# EasyEDA Pro project 农装_2025-08-27.epro, board PCB3_1
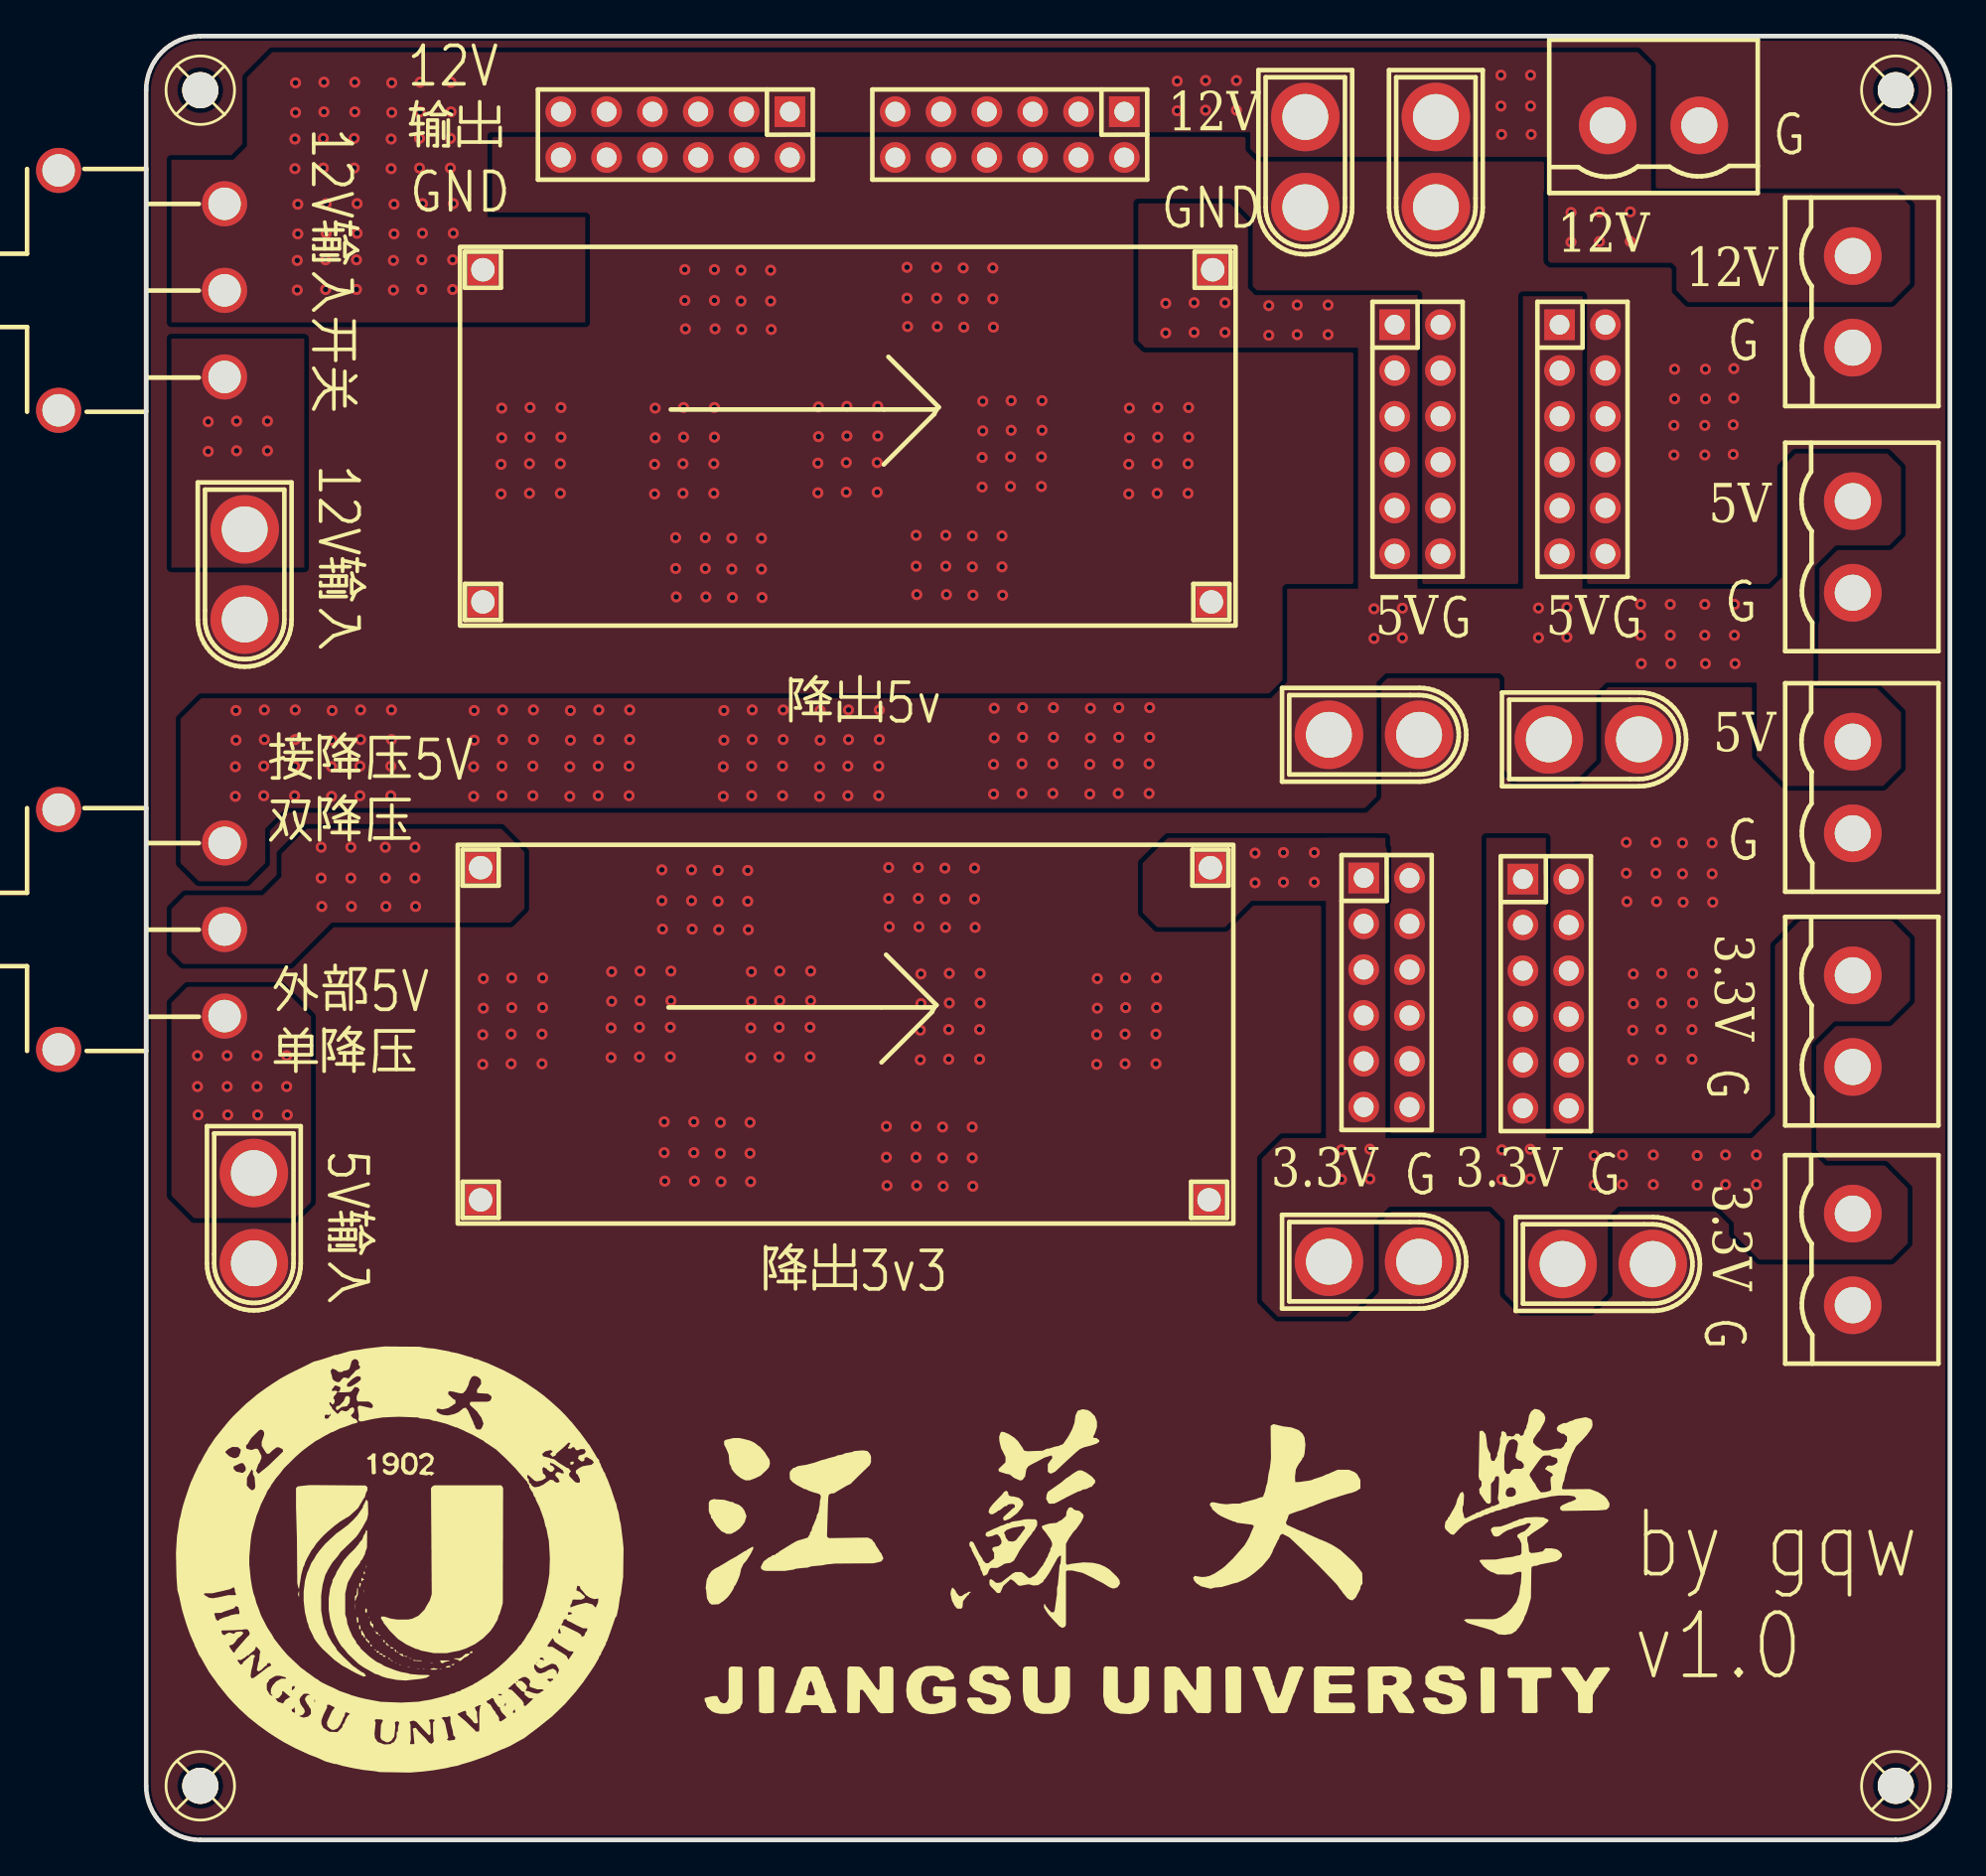
[diagram p2: board, top side]
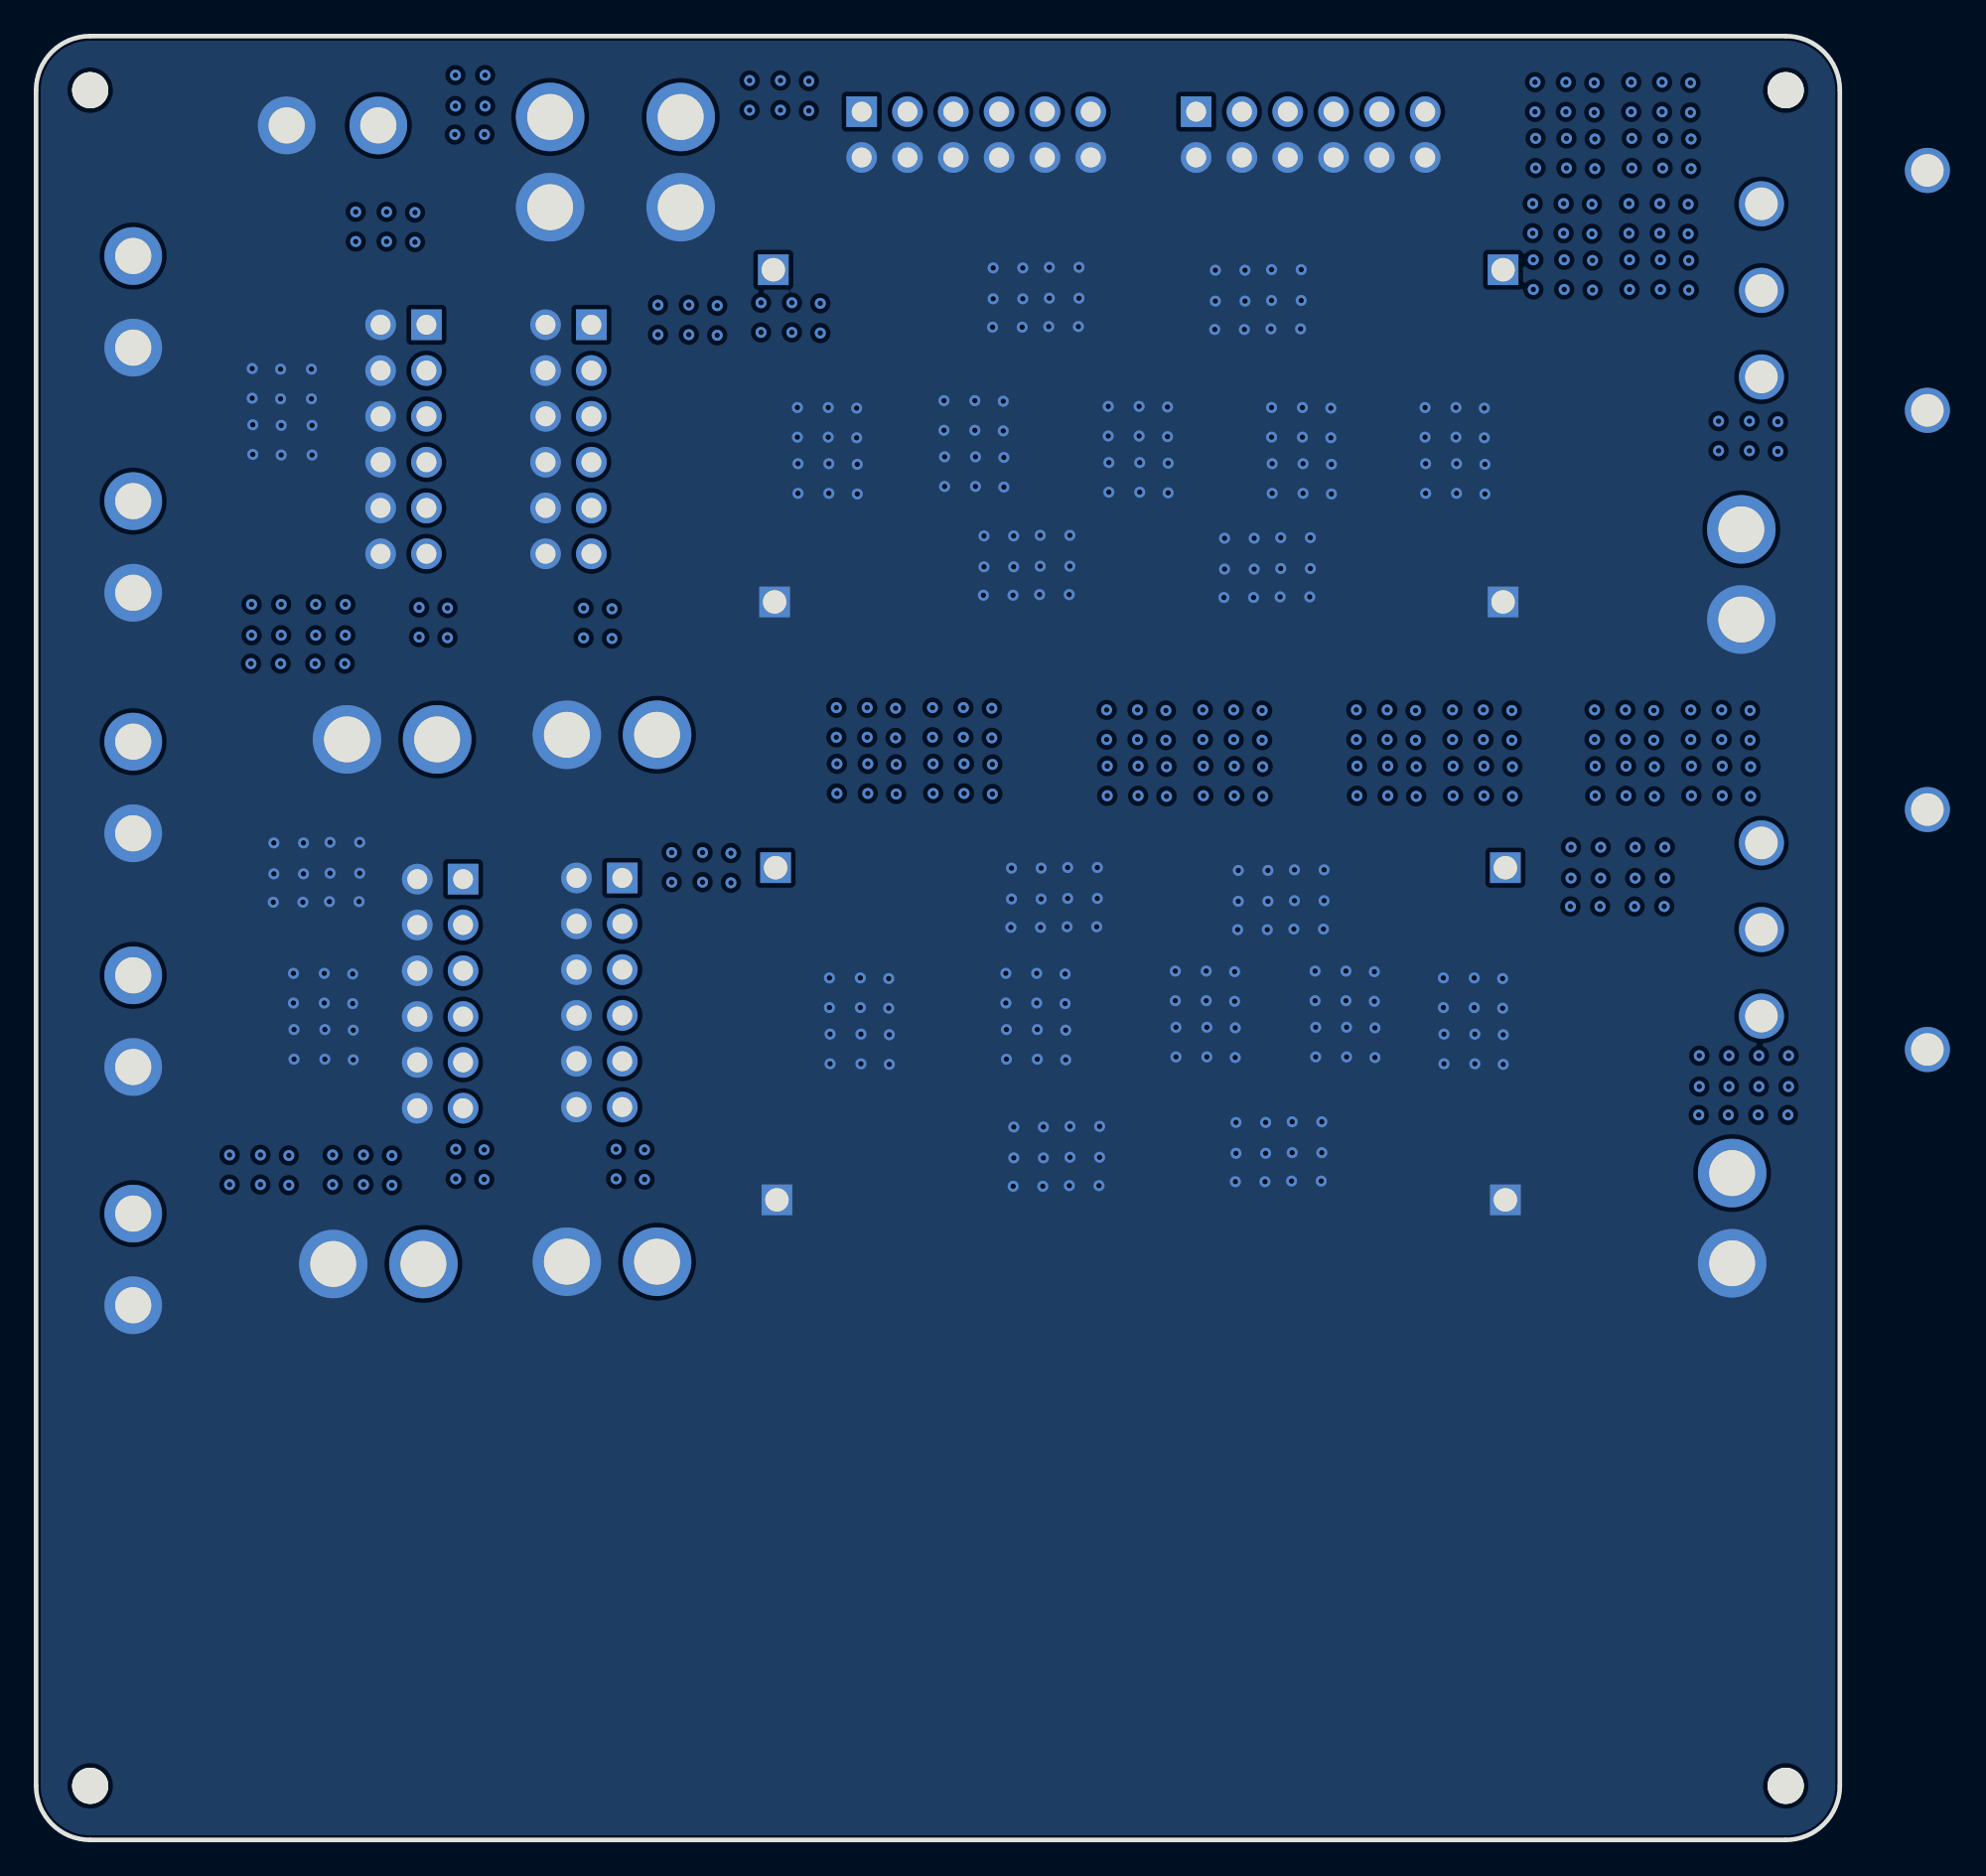
[diagram p3: board, bottom side, seen from below]

Outline 100 x 100 mm; copper layers: Top Layer, Bottom Layer. Coordinates in mm from the lower left corner of the outline.
Outline path: 0,97 0,3 arc(0.88,0.88) 3,0 97,0 arc(99.12,0.88) 100,3 100,97 arc(99.12,99.12) 97,100 3,100 arc(0.88,99.12) 0,97
Stack: Top Layer 0.035mm / Dielectric1 1.51mm FR4 er 4.5 / Bottom Layer 0.035mm

## Design rules (mm)
template: 自定义配置
spacing copperThickness1oz (default): track to track 0.102, other pairs 0.152 to 0.3
spacing copperThickness2oz: track to track 0.203, other pairs 0.152 to 0.3
track width copperThickness1oz (default): min 0.127, default 0.254, max 2.54
track width copperThickness2oz: min 0.203, default 0.254, max 2.54
differential pair differentialPair (default): width min 0.127, default 0.254, max 2.54; gap min 0.152, default 0.152
via viaSize (default): diameter min 0.5, default 0.61, max 10; hole min 0.3, default 0.305, max 6.299

## Placement (name value [footprint] x y rotation side)
CN1  XT30U-M  [CONN-TH_XT30U-M]  5.46 70.16 270 top
CN3  XT30U-M  [CONN-TH_XT30U-M]  5.97 34.47 270 top
CN49  DB2EVC-5.08-2P-GN  [CONN-TH_2P-P5.08_DB2EVC-5.08-2P]  94.62 71.68 90 top
CN50  DB2EVC-5.08-2P-GN  [CONN-TH_2P-P5.08_DB2EVC-5.08-2P]  94.62 32.18 90 top
CN51  XT30U-M  [CONN-TH_XT30U-M]  64.26 93.02 270 top
CN52  XT30U-M  [CONN-TH_XT30U-M]  71.5 93.02 270 top
CN53  DB2EVC-5.08-2P-GN  [CONN-TH_2P-P5.08_DB2EVC-5.08-2P]  83.57 95.05 180 top
CN54  DB2EVC-5.08-2P-GN  [CONN-TH_2P-P5.08_DB2EVC-5.08-2P]  94.62 85.27 90 top
CN55  DB2EVC-5.08-2P-GN  [CONN-TH_2P-P5.08_DB2EVC-5.08-2P]  94.62 45.39 90 top
CN56  DB2EVC-5.08-2P-GN  [CONN-TH_2P-P5.08_DB2EVC-5.08-2P]  94.62 58.34 90 top
CN57  XT30U-M  [CONN-TH_XT30U-M]  68.07 61.27 0 top
CN58  XT30U-M  [CONN-TH_XT30U-M]  80.26 61.01 0 top
CN59  XT30U-M  [CONN-TH_XT30U-M]  68.07 32.06 0 top
CN60  XT30U-M  [CONN-TH_XT30U-M]  81.03 31.93 0 top
P1  双排针2.54mm2*6排针  [HDR-TH_12P-P2.54-V-M-R2-C6-S2.54]  79.63 77.65 270 top
P2  双排针2.54mm2*6排针  [HDR-TH_12P-P2.54-V-M-R2-C6-S2.54]  68.77 46.98 270 top
P3  双排针2.54mm2*6排针  [HDR-TH_12P-P2.54-V-M-R2-C6-S2.54]  29.34 94.54 180 top
P4  双排针2.54mm2*6排针  [HDR-TH_12P-P2.54-V-M-R2-C6-S2.54]  47.88 94.54 180 top
P5  双排针2.54mm2*6排针  [HDR-TH_12P-P2.54-V-M-R2-C6-S2.54]  70.49 77.65 270 top
P6  双排针2.54mm2*6排针  [HDR-TH_12P-P2.54-V-M-R2-C6-S2.54]  77.6 46.91 270 top
SCREW1  -  [M2螺丝]  97 3 0 top
SCREW2  -  [M2螺丝]  3 3 0 top
SCREW3  -  [M2螺丝]  97 97 0 top
SCREW4  -  [M2螺丝]  3 97 0 top
SW1  SS-12D11L5  [SW-TH_SS-12D11L5]  -0.25 85.9 90 top
SW2  SS-12D11L5  [SW-TH_SS-12D11L5]  -0.25 50.47 90 top
U2  -  [lm2596s模块]  38.86 79.3 0 top
U3  -  [lm2596s模块]  38.74 46.15 0 top

## Footprints (pads in the part's own frame, mm; a bottom-side part is the same pattern mirrored in y, then rotated)
CONN-TH_2P-P5.08_DB2EVC-5.08-2P
  round 3.2 hole 2: 1(-2.54,0) 2(2.54,0)
CONN-TH_XT30U-M
  round 3.8 hole 2.54: 1(-2.5,0) 2(2.5,0)
HDR-TH_12P-P2.54-V-M-R2-C6-S2.54
  rect 1.7x1.7 hole 1.1: 1(-6.35,-1.27)
  round 1.7 hole 1.1: 2(-6.35,1.27) 3(-3.81,-1.27) 4(-3.81,1.27) 5(-1.27,-1.27) 6(-1.27,1.27) 7(1.27,-1.27) 8(1.27,1.27) 9(3.81,-1.27) 10(3.81,1.27) 11(6.35,-1.27) 12(6.35,1.27)
lm2596s模块
  rect 1.7x1.7 hole 1.3: 1(-20.193,7.747) 2(-20.193,-10.668) 3(20.266,7.747) 4(20.193,-10.668)
M2螺丝
  round 2 hole 2: 1(0,0)
SW-TH_SS-12D11L5
  round 2.5 hole 1.8: 1(-4.8,-4.6) 2(0,-4.6) 3(4.8,-4.6) 4(-6.65,4.6) 5(6.65,4.6)

## Nets
3V3: CN50.2 CN55.2 CN59.1 CN60.1 P2.1 P2.3 P2.5 P2.7 P2.9 P2.11 P6.1 P6.3 P6.5 P6.7 P6.9 P6.11 U3.3
5V: CN49.2 CN56.2 CN57.1 CN58.1 P1.1 P1.3 P1.5 P1.7 P1.9 P1.11 P5.1 P5.3 P5.5 P5.7 P5.9 P5.11 SW2.3 U2.3
12V: CN51.1 CN52.1 CN53.2 CN54.2 P3.1 P3.3 P3.5 P3.7 P3.9 P3.11 P4.1 P4.3 P4.5 P4.7 P4.9 P4.11 SW1.2 SW1.3 U2.1
GND: CN1.2 CN3.2 CN49.1 CN50.1 CN51.2 CN52.2 CN53.1 CN54.1 CN55.1 CN56.1 CN57.2 CN58.2 CN59.2 CN60.2 P1.2 P1.4 P1.6 P1.8 P1.10 P1.12 P2.2 P2.4 P2.6 P2.8 P2.10 P2.12 P3.2 P3.4 P3.6 P3.8 P3.10 P3.12 P4.2 P4.4 P4.6 P4.8 P4.10 P4.12 P5.2 P5.4 P5.6 P5.8 P5.10 P5.12 P6.2 P6.4 P6.6 P6.8 P6.10 P6.12 U2.2 U2.4 U3.2 U3.4
$1N1529: CN1.1 SW1.1
$1N4066: CN3.1 SW2.1
$1N4071: SW2.2 U3.1

Pads without a net: SCREW1 1; SCREW2 1; SCREW3 1; SCREW4 1; SW1 4 5; SW2 4 5

## Via types
v1: diameter 0.61, hole 0.305, Top Layer to Bottom Layer, 502 vias

## Routing (per net, layer and track width the routed paths; a pad name or vN(x,y) marks a point on that pad's centre or on a via; arc(x,y) is an arc through that point)
3V3:
  vias: v1(61.48,54.7) v1(61.48,53.06) v1(63.05,54.74) v1(63.05,53.09) v1(64.76,54.74) v1(64.76,53.09) v1(66.27,38.26) v1(66.27,36.61) v1(67.84,38.29) v1(67.84,36.65) v1(75.16,38.26) v1(75.16,36.61) v1(76.73,38.29) v1(76.73,36.65) v1(80.27,37.94) v1(80.27,36.3) v1(81.85,37.97) v1(81.85,36.33) v1(83.56,37.97) v1(83.56,36.33) v1(85.99,37.94) v1(85.99,36.3) v1(87.56,37.97) v1(87.56,36.33) v1(89.27,37.97) v1(89.27,36.33)
5V:
  vias: v1(4.94,59.5) v1(4.94,57.85) v1(4.98,62.61) v1(4.98,60.97) v1(6.52,59.53) v1(6.52,57.89) v1(6.55,62.64) v1(6.55,61) v1(8.23,59.53) v1(8.23,57.89) v1(8.26,62.64) v1(8.26,61) v1(10.31,62.61) v1(10.31,60.97) v1(10.28,59.5) v1(10.28,57.85) v1(11.89,62.64) v1(11.89,61) v1(11.85,59.53) v1(11.85,57.89) v1(13.6,62.64) v1(13.6,61) v1(13.56,59.53) v1(13.56,57.89) v1(18.19,62.61) v1(18.19,60.97) v1(18.15,59.5) v1(18.15,57.85) v1(19.73,59.53) v1(19.73,57.89) v1(19.76,62.64) v1(19.76,61) v1(21.44,59.53) v1(21.44,57.89) v1(21.47,62.64) v1(21.47,61) v1(23.52,62.61) v1(23.52,60.97) v1(23.49,59.5) v1(23.49,57.85) v1(25.09,62.64) v1(25.09,61) v1(25.06,59.53) v1(25.06,57.89) v1(26.81,62.64) v1(26.81,61) v1(26.77,59.53) v1(26.77,57.89) v1(32.03,62.61) v1(32.03,60.97) v1(32,59.5) v1(32,57.85) v1(33.6,62.64) v1(33.6,61) v1(33.57,59.53) v1(33.57,57.89) v1(35.31,62.64) v1(35.31,61) v1(35.28,59.53) v1(35.28,57.89) v1(37.33,59.5) v1(37.33,57.85) v1(37.36,62.61) v1(37.36,60.97) v1(38.94,62.64) v1(38.94,61) v1(38.9,59.53) v1(38.9,57.89) v1(40.65,62.64) v1(40.65,61) v1(40.62,59.53) v1(40.62,57.89) v1(47.01,62.74) v1(47.01,61.09) v1(46.98,59.62) v1(46.98,57.98) v1(48.59,62.77) v1(48.59,61.13) v1(48.56,59.66) v1(48.56,58.01) v1(50.3,62.77) v1(50.3,61.13) v1(50.27,59.66) v1(50.27,58.01) v1(52.35,62.74) v1(52.35,61.09) v1(52.32,59.62) v1(52.32,57.98) v1(53.92,62.77) v1(53.92,61.13) v1(53.89,59.66) v1(53.89,58.01) v1(55.63,62.77) v1(55.63,61.13) v1(55.6,59.66) v1(55.6,58.01) v1(56.52,85.18) v1(56.52,83.54) v1(58.1,85.22) v1(58.1,83.57) v1(59.81,85.22) v1(59.81,83.57) v1(62.24,85.06) v1(62.24,83.41) v1(63.81,85.09) v1(63.81,83.45) v1(65.52,85.09) v1(65.52,83.45) v1(68.07,68.25) v1(68.07,66.61) v1(69.65,68.28) v1(69.65,66.64) v1(77.19,68.29) v1(77.19,66.65) v1(78.76,68.33) v1(78.76,66.68) v1(82.85,68.5) v1(82.85,66.78) v1(82.89,65.21) v1(84.5,68.5) v1(84.5,66.78) v1(84.53,65.21) v1(86.41,68.5) v1(86.41,66.78) v1(86.44,65.21) v1(88.05,68.5) v1(88.05,66.78) v1(88.09,65.21)
12V:
  vias: v1(8.25,94.29) v1(8.25,92.65) v1(8.28,97.41) v1(8.28,95.77) v1(8.41,90.68) v1(8.41,89.03) v1(8.37,87.56) v1(8.37,85.92) v1(9.82,94.33) v1(9.82,92.68) v1(9.85,97.44) v1(9.85,95.8) v1(9.95,87.6) v1(9.95,85.95) v1(9.98,90.71) v1(9.98,89.07) v1(11.53,94.33) v1(11.53,92.68) v1(11.57,97.44) v1(11.57,95.8) v1(11.69,90.71) v1(11.69,89.07) v1(11.66,87.6) v1(11.66,85.95) v1(13.61,97.41) v1(13.61,95.77) v1(13.58,94.29) v1(13.58,92.65) v1(13.74,90.68) v1(13.74,89.03) v1(13.71,87.56) v1(13.71,85.92) v1(15.19,97.44) v1(15.19,95.8) v1(15.15,94.33) v1(15.15,92.68) v1(15.31,90.71) v1(15.31,89.07) v1(15.28,87.6) v1(15.28,85.95) v1(16.9,97.44) v1(16.9,95.8) v1(16.87,94.33) v1(16.87,92.68) v1(17.03,90.71) v1(17.03,89.07) v1(16.99,87.6) v1(16.99,85.95) v1(57.16,97.5) v1(57.16,95.86) v1(58.73,97.54) v1(58.73,95.89) v1(60.44,97.54) v1(60.44,95.89) v1(75.11,97.83) v1(75.11,96.12) v1(75.14,94.55) v1(76.75,97.83) v1(76.75,96.12) v1(76.78,94.55) v1(78.99,90.22) v1(78.99,88.58) v1(80.57,90.25) v1(80.57,88.61) v1(82.28,90.25) v1(82.28,88.61)
GND:
  vias: v1(18.69,47.75) v1(18.69,46.11) v1(18.66,44.64) v1(18.66,42.99) v1(19.71,79.38) v1(19.71,77.73) v1(19.68,76.26) v1(19.68,74.62) v1(20.23,44.67) v1(20.23,43.03) v1(20.27,47.79) v1(20.27,46.14) v1(21.28,79.41) v1(21.28,77.77) v1(21.25,76.29) v1(21.25,74.65) v1(21.95,44.67) v1(21.95,43.03) v1(21.98,47.79) v1(21.98,46.14) v1(23,79.41) v1(23,77.77) v1(22.96,76.29) v1(22.96,74.65) v1(25.81,48.13) v1(25.81,46.49) v1(25.77,45.02) v1(25.77,43.38) v1(27.35,45.05) v1(27.35,43.41) v1(27.38,48.17) v1(27.38,46.52) v1(28.22,79.38) v1(28.22,77.73) v1(28.19,76.26) v1(28.19,74.62) v1(28.59,53.78) v1(28.59,52.07) v1(28.63,50.5) v1(28.72,39.81) v1(28.72,38.1) v1(28.75,36.53) v1(29.09,48.17) v1(29.09,46.52) v1(29.06,45.05) v1(29.06,43.41) v1(29.35,72.2) v1(29.35,70.48) v1(29.39,68.91) v1(29.79,79.41) v1(29.79,77.77) v1(29.76,76.29) v1(29.76,74.65) v1(29.86,87.05) v1(29.86,85.34) v1(29.9,83.77) v1(30.24,53.78) v1(30.24,52.07) v1(30.27,50.5) v1(30.36,39.81) v1(30.36,38.1) v1(30.4,36.53) v1(31,72.2) v1(31,70.48) v1(31.03,68.91) v1(31.5,87.05) v1(31.5,85.34) v1(31.54,83.77) v1(31.5,79.41) v1(31.5,77.77) v1(31.47,76.29) v1(31.47,74.65) v1(31.71,53.75) v1(31.71,52.04) v1(31.74,50.46) v1(31.83,39.78) v1(31.83,38.07) v1(31.87,36.49) v1(32.47,72.16) v1(32.47,70.45) v1(32.5,68.88) v1(32.98,87.02) v1(32.98,85.31) v1(33.01,83.74) v1(33.35,53.75) v1(33.35,52.04) v1(33.38,50.46) v1(33.52,45.02) v1(33.52,43.38) v1(33.48,39.78) v1(33.48,38.07) v1(33.51,36.49) v1(33.55,48.13) v1(33.55,46.49) v1(34.11,72.16) v1(34.11,70.45) v1(34.15,68.88) v1(34.62,87.02) v1(34.62,85.31) v1(34.65,83.74) v1(35.13,48.17) v1(35.13,46.52) v1(35.09,45.05) v1(35.09,43.41) v1(36.84,48.17) v1(36.84,46.52) v1(36.81,45.05) v1(36.81,43.41) v1(37.24,76.32) v1(37.24,74.68) v1(37.27,79.44) v1(37.27,77.8) v1(38.85,79.47) v1(38.85,77.83) v1(38.81,76.36) v1(38.81,74.71) v1(40.53,76.36) v1(40.53,74.71) v1(40.56,79.47) v1(40.56,77.83) v1(41.04,39.56) v1(41.04,37.84) v1(41.07,36.27) v1(41.16,53.91) v1(41.16,52.2) v1(41.2,50.62) v1(42.18,87.18) v1(42.18,85.47) v1(42.21,83.9) v1(42.69,72.32) v1(42.69,70.61) v1(42.72,69.04) v1(42.68,39.56) v1(42.68,37.84) v1(42.72,36.27) v1(42.81,53.91) v1(42.81,52.2) v1(42.84,50.62) v1(42.92,44.89) v1(42.92,43.25) v1(42.95,48.01) v1(42.95,46.36) v1(43.82,87.18) v1(43.82,85.47) v1(43.86,83.9) v1(44.15,39.52) v1(44.15,37.81) v1(44.19,36.24) v1(44.33,72.32) v1(44.33,70.61) v1(44.28,53.87) v1(44.28,52.16) v1(44.31,50.59) v1(44.37,69.04) v1(44.53,48.04) v1(44.53,46.4) v1(44.49,44.92) v1(44.49,43.28) v1(45.3,87.15) v1(45.3,85.44) v1(45.33,83.86) v1(45.8,72.29) v1(45.8,70.58) v1(45.84,69) v1(45.8,39.52) v1(45.8,37.81) v1(45.83,36.24) v1(45.92,53.87) v1(45.92,52.16) v1(45.96,50.59) v1(46.24,48.04) v1(46.24,46.4) v1(46.2,44.92) v1(46.2,43.28) v1(46.35,76.64) v1(46.35,75) v1(46.38,79.76) v1(46.38,78.11) v1(46.94,87.15) v1(46.94,85.44) v1(46.97,83.86) v1(47.45,72.29) v1(47.45,70.58) v1(47.48,69) v1(47.92,76.67) v1(47.92,75.03) v1(47.95,79.79) v1(47.95,78.15) v1(49.63,76.67) v1(49.63,75.03) v1(49.67,79.79) v1(49.67,78.15) v1(52.73,47.75) v1(52.73,46.11) v1(52.7,44.64) v1(52.7,42.99) v1(54.3,47.79) v1(54.3,46.14) v1(54.27,44.67) v1(54.27,43.03) v1(54.51,79.38) v1(54.51,77.73) v1(54.47,76.26) v1(54.47,74.62) v1(56.05,76.29) v1(56.05,74.65) v1(56.02,47.79) v1(56.02,46.14) v1(55.98,44.67) v1(55.98,43.03) v1(56.08,79.41) v1(56.08,77.77) v1(57.79,79.41) v1(57.79,77.77) v1(57.76,76.29) v1(57.76,74.65) v1(82.06,55.3) v1(82.06,53.59) v1(82.09,52.02) v1(82.45,48.01) v1(82.45,46.36) v1(82.41,44.89) v1(82.41,43.25) v1(83.7,55.3) v1(83.7,53.59) v1(83.74,52.02) v1(84.02,48.04) v1(84.02,46.4) v1(83.99,44.92) v1(83.99,43.28) v1(84.73,81.53) v1(84.73,79.89) v1(84.7,78.42) v1(84.7,76.78) v1(85.17,55.27) v1(85.17,53.56) v1(85.21,51.99) v1(85.73,48.04) v1(85.73,46.4) v1(85.7,44.92) v1(85.7,43.28) v1(86.45,81.53) v1(86.45,79.89) v1(86.41,78.42) v1(86.41,76.78) v1(86.82,55.27) v1(86.82,53.56) v1(86.85,51.99) v1(88.02,81.57) v1(88.02,79.92) v1(87.99,78.45) v1(87.99,76.81)
$1N1529:
  vias: v1(3.44,78.62) v1(3.44,76.98) v1(5.01,78.65) v1(5.01,77.01) v1(6.72,78.65) v1(6.72,77.01)
$1N4066:
  vias: v1(2.84,43.48) v1(2.84,41.77) v1(2.88,40.19) v1(4.49,43.48) v1(4.49,41.77) v1(4.52,40.19) v1(6.15,43.48) v1(6.15,41.77) v1(6.18,40.19) v1(7.79,43.48) v1(7.79,41.77) v1(7.82,40.19)
$1N4071:
  vias: v1(9.7,55.03) v1(9.7,53.32) v1(9.74,51.75) v1(11.35,55.03) v1(11.35,53.32) v1(11.38,51.75) v1(13.26,55.03) v1(13.26,53.32) v1(13.29,51.75) v1(14.9,55.03) v1(14.9,53.32) v1(14.94,51.75)

## Copper pours and planes (outline as drawn; the poured copper is in the pictures)
3V3 on Top Layer: 55.25,54.15 56.64,55.55 68.19,55.55 68.77,54.98 68.77,52.06 61.28,52.06 59.82,50.6 56.05,50.6 55.25,51.4
3V3 on Top Layer: 62.74,29.01 61.85,29.9 61.85,37.77 62.99,38.91 89.03,38.91 90.3,40.18 90.3,49.58 91.69,50.98 96.77,50.98 97.79,49.96 97.79,46.53 96.63,45.37 93.58,45.37 92.33,44.12 92.33,38.15 93.09,37.39 96.39,37.39 97.66,36.12 97.66,33.07 96.75,32.16 89.43,32.16 88.01,33.58 88.01,34.21 87.12,35.1 81.61,35.1 81.03,34.53 81.03,30.27 80.09,29.33 76.26,29.33 75.31,30.28 75.31,34.34 74.55,35.1 68.93,35.1 68.08,34.25 68.08,30.47 66.62,29.01
3V3 on Top Layer: 74.29,55.55 77.6,55.55 77.6,35.61 74.29,35.61
3V3 on Top Layer: 65.41,55.55 68.71,55.55 68.71,35.61 65.41,35.61
5V on Top Layer: 76.33,85.59 79.63,85.59 79.63,65.65 76.33,65.65
5V on Top Layer: 67.18,85.65 70.49,85.65 70.49,65.71 67.18,65.71
5V on Top Layer: 54.99,90.73 60.07,90.73 61.09,89.71 61.09,86.03 61.47,85.65 70.1,85.65 70.49,85.27 70.49,83.04 70.18,82.73 55.37,82.73 54.99,83.11
5V on Top Layer: 68.21,57.85 67.56,57.2 7.75,57.2 6.6,56.06 6.6,54.15 5.59,53.14 2.92,53.14 1.91,54.15 1.91,62.15 3.05,63.3 62.36,63.3 63.25,64.19 68.21,64.19
5V on Top Layer: 63.25,76.86 97.29,76.86 97.29,58.32 63.25,58.32
12V on Top Layer: 1.4,99.11 83.44,99.11 83.44,84.12 1.4,84.12
12V on Top Layer: 97.09,91.3 97.79,90.6 97.79,86.28 96.76,85.25 85.49,85.25 84.84,85.9 84.84,87.17 84.58,87.43 77.85,87.43 77.72,87.55 77.72,91.3
GND on Top Layer: -16,108.51 128.14,108.51 128.14,-11 -16,-11
GND on Bottom Layer: -41.91,124.38 156.59,124.38 156.59,-39.83 -41.91,-39.83
$1N1529 on Top Layer: 1.4,83.24 8.76,83.24 8.76,70.54 1.4,70.54
$1N4066 on Top Layer: 1.4,46.41 2.29,47.3 7.49,47.3 9.14,45.64 9.14,35.36 8.25,34.46 2.66,34.46 1.4,35.72
$1N4071 on Top Layer: 1.4,51.61 2.16,52.38 6.48,52.38 7.49,53.39 7.49,54.66 8.89,56.06 19.69,56.06 20.97,54.77 20.97,51.63 20.19,50.85 10.29,50.85 8,48.56 2.03,48.56 1.4,49.2

## Text on the board
Top Silkscreen Layer: GND | G | by gqw / v1.0 | 12V / 输出 | 降出3v3 | 12V | 3.3V | 5V | 12V输入开关 | 12V输入 | 5V输入 | 接降压5V / 双降压 | 外部5V / 单降压 | 降出5v
